# Altium schematic sheet MCU.SchDoc
size 381 x 381 mm; SheetNumber: 2; SheetTotal: 2
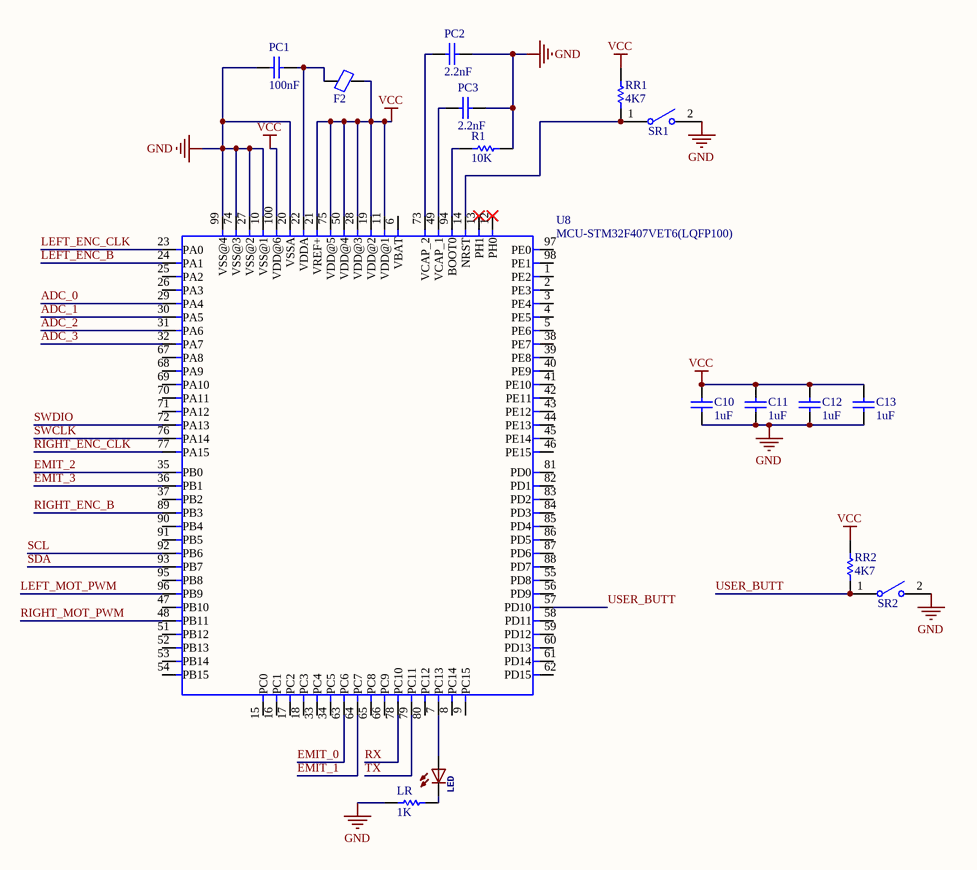
[diagram p0: MCU.SchDoc]

## Parts
C10  1uF  [CAP0603]
C11  1uF  [CAP0603]
C12  1uF  [CAP0603]
C13  1uF  [CAP0603]
F2  Ferrite Bead SMD  [FB0603]  (value not drawn)
LED  LED   OSRAM: - CHIPLED LG R971, LG N971, LY N971, LG Q971, LY Q971, LO R971, LY R971 LH N974, LH R974 LS Q976, LO Q976, LY Q976 LO Q996 - Hyper CHIPLED LW Q18S LB Q993, LB Q99A, LB R99A - SideLED LS A670, LO A670, LY A670, LG A670, LP A670 LB A673, LV A673, LT A673, LW A673 LH A674 LY A675 LS A676, LA A676, LO A676, LY A676, LW A676 LS A679, LY A679, LG A679 -  Hyper Micro SIDELEDÂ® LS Y876, LA Y876, LO Y876, LY Y876 LT Y87S - SmartLED LW L88C, LW L88S LB L89C, LB L89S, LG L890 LS L89K, LO L89K, LY L89K LS L896, LA L896, LO L896, LY L896 - TOPLED LS T670, LO T670, LY T670, LG T670, LP T670 LSG T670, LSP T670, LSY T670, LOP T670, LYG T670 LG T671, LOG T671, LSG T671 LB T673, LV T673, LT T673, LW T673 LH T674 LS T676, LA T676, LO T676, LY T676, LB T676, LH T676, LSB T676, LW T676 LB T67C, LV T67C, LT T67C, LS T67K, LO T67K, LY T67K, LW E67C LS E67B, LA E67B, LO E67B, LY E67B, LB E67C, LV E67C, LT E67C LW T67C LS T679, LY T679, LG T679 LS T770, LO T770, LY T770, LG T770, LP T770 LB T773, LV T773, LT T773, LW T773 LH T774 LS E675, LA E675, LY E675, LS T675 LS T776, LA T776, LO T776, LY T776, LB T776 LHGB T686 LT T68C, LB T68C - Hyper Mini TOPLEDÂ® LB M676 - Mini TOPLED SantanaÂ® LG M470 LS M47K, LO M47K, LY M47K    Source: http://www.osram.convergy.de/  [CHIPLED_0603]  (value not drawn)
LR  1K  [RES0603]
PC1  100nF  [CAP0603]
PC2  2.2nF  [CAP0603]
PC3  2.2nF  [CAP0603]
R1  10K  [RES0603]
RR1  4K7  [RES0603]
RR2  4K7  [RES0603]
SR1  434113050826  [4341x30508x6_6x3.5x5]  (value not drawn)
SR2  434113050826  [4341x30508x6_6x3.5x5]  (value not drawn)
U8  MCU-STM32F407VET6(LQFP100)  [LQFP100-0.5-13.8X13.8MM]

## Nets
GND: C10.1 C11.1 C12.1 C13.1 LR.2 PC1.2 PC2.1 PC3.1 R1.1 SR1.2 SR2.2 U8.10(VSS@1) U8.20(VSSA) U8.27(VSS@2) U8.74(VSS@3) U8.99(VSS@4)
VCC: C10.2 C11.2 C12.2 C13.2 F2.2 RR1.2 RR2.2 U8.11(VDD@1) U8.19(VDD@2) U8.21(VREF+) U8.28(VDD@3) U8.50(VDD@4) U8.75(VDD@5) U8.100(VDD@6)
ADC_0: U8.29(PA4)
ADC_1: U8.30(PA5)
ADC_2: U8.31(PA6)
ADC_3: U8.32(PA7)
EMIT_0: U8.63(PC6)
EMIT_1: U8.64(PC7)
EMIT_2: U8.35(PB0)
EMIT_3: U8.36(PB1)
LEFT_ENC_B: U8.24(PA1)
LEFT_ENC_CLK: U8.23(PA0)
LEFT_MOT_PWM: U8.96(PB9)
RIGHT_ENC_B: U8.89(PB3)
RIGHT_ENC_CLK: U8.77(PA15)
RIGHT_MOT_PWM: U8.48(PB11)
RX: U8.78(PC10)
SCL: U8.92(PB6)
SDA: U8.93(PB7)
SWCLK: U8.76(PA14)
SWDIO: U8.72(PA13)
TX: U8.79(PC11)
USER_BUTT: RR2.1 SR2.1 U8.57(PD10)
NetF2_1: F2.1 PC1.1 U8.22(VDDA)
NetLED_A: LED.A U8.7(PC13)
NetLED_C: LED.C LR.1
NetPC2_2: PC2.2 U8.73(VCAP_2)
NetPC3_2: PC3.2 U8.49(VCAP_1)
NetR1_2: R1.2 U8.94(BOOT0)
NetRR1_1: RR1.1 SR1.1 U8.14(NRST)

Not connected (* = marked no-connect by the designer): U8 1(PE2) 2(PE3) 3(PE4) 4(PE5) 5(PE6) 6(VBAT) 8(PC14) 9(PC15) 12(PH0)* 13(PH1)* 15(PC0) 16(PC1) 17(PC2) 18(PC3) 25(PA2) 26(PA3) 33(PC4) 34(PC5) 37(PB2) 38(PE7) 39(PE8) 40(PE9) 41(PE10) 42(PE11) 43(PE12) 44(PE13) 45(PE14) 46(PE15) 47(PB10) 51(PB12) 52(PB13) 53(PB14) 54(PB15) 55(PD8) 56(PD9) 58(PD11) 59(PD12) 60(PD13) 61(PD14) 62(PD15) 65(PC8) 66(PC9) 67(PA8) 68(PA9) 69(PA10) 70(PA11) 71(PA12) 80(PC12) 81(PD0) 82(PD1) 83(PD2) 84(PD3) 85(PD4) 86(PD5) 87(PD6) 88(PD7) 90(PB4) 91(PB5) 95(PB8) 97(PE0) 98(PE1)

## Library data of the parts
C10-C13 = CAP SMD PACKAGE: 0603 CAPACITOR SMD; Designer: Abbas Basereh; Desc.: CAP SMD TOTAL PACKAGES; VALUE: 100nF; Data: 2017-3-10
F2 = Ferrite Bead SMD Package: Designer: Ali Hafizi
LED = LEDCHIPLED_0603
LR R1 = RES SMD PACKAGE: TOTAL SMD RESISTOR PACK; Designer: Abbas Basereh; Desc.: RES SMD PAKAGES; Data: 2017-3-10
PC1 = CAP SMD PACKAGE: TOTAL CAPACITOR SMD PACK; Designer: Abbas Basereh; Desc.: CAP SMD TOTAL PACKAGES; Data: 2017-3-10; VALUE: 100nF
PC2 PC3 = CAP SMD PACKAGE: TOTAL CAPACITOR SMD PACK; Designer: Abbas Basereh; Desc.: CAP SMD TOTAL PACKAGES; VALUE: 100nF; Data: 2017-3-10
RR1 RR2 = RES SMD PACKAGE: 0603 RESISTOR; Designer: Abbas Basereh; Desc.: RES SMD PAKAGES; Data: 2017-3-10
SR1 SR2 = 434113050826: WS-TASV 6.0x3.5mm Tact Switch, J-Bend SMD version; Operation Force: 260g; ComponentLink1Description: Manufacturer; ComponentLink1URL: http://www.we-online.de; ComponentLink2Description: Datasheet; ComponentLink2URL: http://katalog.we-online.de/em/datasheet/4341x3xxx8x6.pdf; Part Number: 434113050826; Published Date: June 2017; Publisher: Wurth Elektronik; Life Cycle: 30000 cycles; Size: 6x3.5x5 mm
U8 = MCU-STM32F407VET6(LQFP100): ARMÂ® CortexÂ®-M4 STM32F4 Microcontroller IC 32-Bit 168MHz 512KB _512K x 8_ FLASH 100-LQFP _14x14_; MF: STMicroelectronics; Package: LQFP-100 STMicroelectronics; Value: *; Price: None; MP: STM32F407VET6; Availability: Unavailable; SnapEDA_Link: https://www.snapeda.com/parts/STM32F407VET6/STMicroelectronics/view-part/45214/?ref=snap